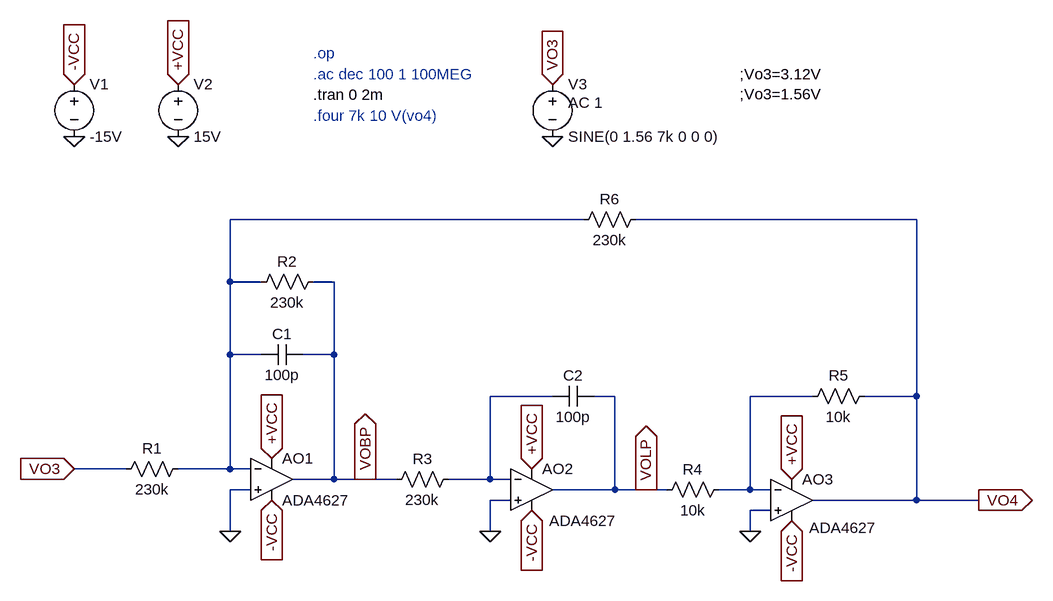
[diagram p0: schematic FTT.asc]
FTT.asc, the LTspice schematic file:
Version 4.1
SHEET 1 880 680
WIRE 128 -224 -416 -224
WIRE 640 -224 208 -224
WIRE -416 -128 -416 -224
WIRE -368 -128 -416 -128
WIRE -256 -128 -288 -128
WIRE -416 -16 -416 -128
WIRE -368 -16 -416 -16
WIRE -256 -16 -256 -128
WIRE -256 -16 -304 -16
WIRE 80 48 -16 48
WIRE 176 48 144 48
WIRE 480 48 384 48
WIRE 640 48 640 -224
WIRE 640 48 560 48
WIRE -576 160 -656 160
WIRE -416 160 -416 -16
WIRE -416 160 -496 160
WIRE -384 160 -416 160
WIRE -256 176 -256 -16
WIRE -256 176 -320 176
WIRE -208 176 -256 176
WIRE -160 176 -208 176
WIRE -16 176 -16 48
WIRE -16 176 -80 176
WIRE 16 176 -16 176
WIRE -384 192 -416 192
WIRE 176 192 176 48
WIRE 176 192 80 192
WIRE 224 192 176 192
WIRE 256 192 224 192
WIRE 384 192 384 48
WIRE 384 192 336 192
WIRE 416 192 384 192
WIRE 16 208 -16 208
WIRE 640 208 640 48
WIRE 640 208 480 208
WIRE 736 208 640 208
WIRE 416 224 384 224
WIRE -416 256 -416 192
WIRE -16 256 -16 208
WIRE 384 256 384 224
FLAG -416 256 0
FLAG -16 256 0
FLAG -352 208 -VCC
IOPIN -352 208 In
FLAG -352 144 +VCC
IOPIN -352 144 In
FLAG 48 160 +VCC
IOPIN 48 160 In
FLAG 48 224 -VCC
IOPIN 48 224 In
FLAG 384 256 0
FLAG 448 240 -VCC
IOPIN 448 240 In
FLAG 448 176 +VCC
IOPIN 448 176 In
FLAG 736 208 VO4
IOPIN 736 208 Out
FLAG -208 176 VOBP
IOPIN -208 176 Out
FLAG 224 192 VOLP
IOPIN 224 192 Out
FLAG -656 -352 0
FLAG -496 -352 0
FLAG -496 -432 +VCC
IOPIN -496 -432 In
FLAG -656 -432 -VCC
IOPIN -656 -432 In
FLAG 80 -352 0
FLAG 80 -432 VO3
IOPIN 80 -432 In
FLAG -656 160 VO3
IOPIN -656 160 In
SYMBOL res -480 144 R90
WINDOW 0 0 56 VBottom 2
WINDOW 3 32 56 VTop 2
SYMATTR InstName R1
SYMATTR Value 230k
SYMBOL OpAmps\\ADA4627 -352 112 R0
SYMATTR InstName AO1
SYMBOL cap -304 -32 R90
WINDOW 0 0 32 VBottom 2
WINDOW 3 32 32 VTop 2
SYMATTR InstName C1
SYMATTR Value 100p
SYMBOL res -272 -144 R90
WINDOW 0 0 56 VBottom 2
WINDOW 3 32 56 VTop 2
SYMATTR InstName R2
SYMATTR Value 230k
SYMBOL res -64 160 R90
WINDOW 0 0 56 VBottom 2
WINDOW 3 32 56 VTop 2
SYMATTR InstName R3
SYMATTR Value 230k
SYMBOL OpAmps\\ADA4627 48 128 R0
WINDOW 3 27 112 Left 2
SYMATTR InstName AO2
SYMBOL cap 144 32 R90
WINDOW 0 0 32 VBottom 2
WINDOW 3 32 32 VTop 2
SYMATTR InstName C2
SYMATTR Value 100p
SYMBOL res 352 176 R90
WINDOW 0 0 56 VBottom 2
WINDOW 3 32 56 VTop 2
SYMATTR InstName R4
SYMATTR Value 10k
SYMBOL OpAmps\\ADA4627 448 144 R0
WINDOW 3 27 107 Left 2
SYMATTR InstName AO3
SYMBOL res 576 32 R90
WINDOW 0 0 56 VBottom 2
WINDOW 3 32 56 VTop 2
SYMATTR InstName R5
SYMATTR Value 10k
SYMBOL res 224 -240 R90
WINDOW 0 0 56 VBottom 2
WINDOW 3 32 56 VTop 2
SYMATTR InstName R6
SYMATTR Value 230k
SYMBOL voltage -656 -448 R0
WINDOW 123 0 0 Left 0
WINDOW 39 0 0 Left 0
SYMATTR InstName V1
SYMATTR Value -15V
SYMBOL voltage -496 -448 R0
WINDOW 123 24 44 Left 2
WINDOW 39 0 0 Left 0
SYMATTR InstName V2
SYMATTR Value 15V
SYMBOL voltage 80 -448 R0
WINDOW 123 24 44 Left 2
WINDOW 39 0 0 Left 0
SYMATTR Value2 AC 1
SYMATTR InstName V3
SYMATTR Value SINE(0 1.56 7k 0 0 0)
TEXT -288 -448 Left 2 ;.ac dec 100 1 100MEG
TEXT -288 -416 Left 2 !.tran 0 2m
TEXT -288 -384 Left 2 ;.four 7k 10 V(vo4)
TEXT -288 -480 Left 2 ;.op
TEXT 368 -448 Left 2 !;Vo3=3.12V\n;Vo3=1.56V

The netlist it stands for:
* FTT.asc
R1 N001 VO3 230k
X§AO1 0 N001 +VCC -VCC VOBP ADA4627  ; pins In+ In- V+ V- OUT
C1 VOBP N001 100p
R2 VOBP N001 230k
R3 N002 VOBP 230k
X§AO2 0 N002 +VCC -VCC VOLP ADA4627  ; pins In+ In- V+ V- OUT
C2 VOLP N002 100p
R4 N003 VOLP 10k
X§AO3 0 N003 +VCC -VCC VO4 ADA4627  ; pins In+ In- V+ V- OUT
R5 VO4 N003 10k
R6 VO4 N001 230k
V1 -VCC 0 -15V
V2 +VCC 0 15V
V3 VO3 0 SINE(0 1.56 7k 0 0 0) AC 1
* .ac dec 100 1 100MEG
.tran 0 2m
* .four 7k 10 V(vo4)
* .op
;Vo3=3.12V
;Vo3=1.56V
.backanno
.end